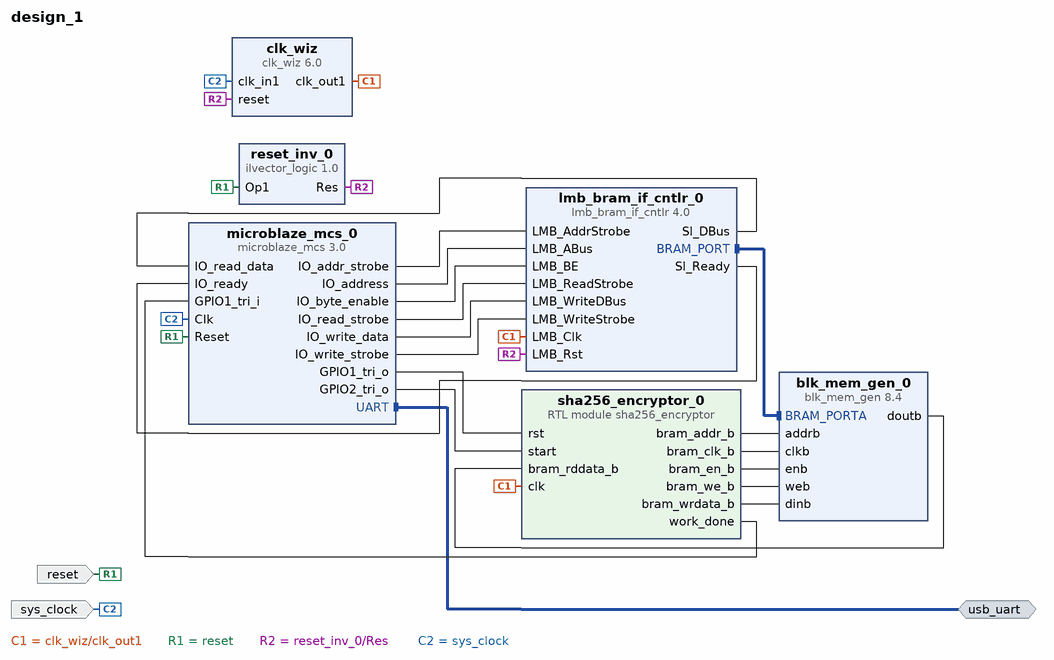
[diagram p0: block diagram of the top level]
# Vivado block design design_1, xc7a100tcsg324-1, Vivado 2025.2
create_bd_design design_1

create_bd_intf_port -mode Master -vlnv xilinx.com:interface:uart_rtl:1.0 usb_uart
create_bd_port -dir I -type rst reset
set_property -dict {CONFIG.POLARITY ACTIVE_LOW} [get_bd_ports reset]
create_bd_port -dir I -type clk sys_clock
set_property -dict {CONFIG.FREQ_HZ 100000000 CONFIG.PHASE 0.0} [get_bd_ports sys_clock]

create_bd_cell -type module -reference sha256_encryptor sha256_encryptor_0
create_bd_cell -type ip -vlnv xilinx.com:ip:blk_mem_gen:8.4 blk_mem_gen_0
set_property -dict {CONFIG.Memory_Type True_Dual_Port_RAM CONFIG.use_bram_block BRAM_Controller} [get_bd_cells blk_mem_gen_0]
create_bd_cell -type ip -vlnv xilinx.com:ip:microblaze_mcs:3.0 microblaze_mcs_0
set_property -dict [list \
  CONFIG.CLK_BOARD_INTERFACE sys_clock \
  CONFIG.GPI1_SIZE 1 \
  CONFIG.GPO1_SIZE 1 \
  CONFIG.GPO2_SIZE 1 \
  CONFIG.RESET_BOARD_INTERFACE reset \
  CONFIG.TRACE 0 \
  CONFIG.UART_BAUDRATE 115200 \
  CONFIG.UART_BOARD_INTERFACE usb_uart \
  CONFIG.USE_BOARD_FLOW true \
  CONFIG.USE_GPI1 1 \
  CONFIG.USE_GPO1 1 \
  CONFIG.USE_GPO2 1 \
  CONFIG.USE_GPO3 0 \
  CONFIG.USE_IO_BUS 1 \
] [get_bd_cells microblaze_mcs_0]
create_bd_cell -type ip -vlnv xilinx.com:ip:lmb_bram_if_cntlr:4.0 lmb_bram_if_cntlr_0
create_bd_cell -type ip -vlnv xilinx.com:ip:clk_wiz:6.0 clk_wiz
set_property -dict [list \
  CONFIG.CLKOUT1_REQUESTED_OUT_FREQ 100.0 \
  CONFIG.CLK_IN1_BOARD_INTERFACE sys_clock \
  CONFIG.RESET_BOARD_INTERFACE reset \
  CONFIG.USE_BOARD_FLOW true \
] [get_bd_cells clk_wiz]
create_bd_cell -type inline_hdl -vlnv xilinx.com:inline_hdl:ilvector_logic:1.0 reset_inv_0
set_property -dict {CONFIG.C_OPERATION not CONFIG.C_SIZE 1} [get_bd_cells reset_inv_0]

# ---- connections ----

connect_bd_intf_net [get_bd_intf_pins blk_mem_gen_0/BRAM_PORTA] [get_bd_intf_pins lmb_bram_if_cntlr_0/BRAM_PORT]
connect_bd_intf_net [get_bd_intf_ports usb_uart] [get_bd_intf_pins microblaze_mcs_0/UART]
connect_bd_net [get_bd_pins blk_mem_gen_0/doutb] [get_bd_pins sha256_encryptor_0/bram_rddata_b]
connect_bd_net [get_bd_pins clk_wiz/clk_out1] [get_bd_pins lmb_bram_if_cntlr_0/LMB_Clk] [get_bd_pins sha256_encryptor_0/clk]
connect_bd_net [get_bd_pins lmb_bram_if_cntlr_0/Sl_DBus] [get_bd_pins microblaze_mcs_0/IO_read_data]
connect_bd_net [get_bd_pins lmb_bram_if_cntlr_0/Sl_Ready] [get_bd_pins microblaze_mcs_0/IO_ready]
connect_bd_net [get_bd_pins microblaze_mcs_0/GPIO1_tri_o] [get_bd_pins sha256_encryptor_0/rst]
connect_bd_net [get_bd_pins microblaze_mcs_0/GPIO2_tri_o] [get_bd_pins sha256_encryptor_0/start]
connect_bd_net [get_bd_pins microblaze_mcs_0/IO_addr_strobe] [get_bd_pins lmb_bram_if_cntlr_0/LMB_AddrStrobe]
connect_bd_net [get_bd_pins microblaze_mcs_0/IO_address] [get_bd_pins lmb_bram_if_cntlr_0/LMB_ABus]
connect_bd_net [get_bd_pins microblaze_mcs_0/IO_byte_enable] [get_bd_pins lmb_bram_if_cntlr_0/LMB_BE]
connect_bd_net [get_bd_pins microblaze_mcs_0/IO_read_strobe] [get_bd_pins lmb_bram_if_cntlr_0/LMB_ReadStrobe]
connect_bd_net [get_bd_pins microblaze_mcs_0/IO_write_data] [get_bd_pins lmb_bram_if_cntlr_0/LMB_WriteDBus]
connect_bd_net [get_bd_pins microblaze_mcs_0/IO_write_strobe] [get_bd_pins lmb_bram_if_cntlr_0/LMB_WriteStrobe]
connect_bd_net [get_bd_ports reset] [get_bd_pins microblaze_mcs_0/Reset] [get_bd_pins reset_inv_0/Op1]
connect_bd_net [get_bd_pins reset_inv_0/Res] [get_bd_pins clk_wiz/reset] [get_bd_pins lmb_bram_if_cntlr_0/LMB_Rst]
connect_bd_net [get_bd_pins sha256_encryptor_0/bram_addr_b] [get_bd_pins blk_mem_gen_0/addrb]
connect_bd_net [get_bd_pins sha256_encryptor_0/bram_clk_b] [get_bd_pins blk_mem_gen_0/clkb]
connect_bd_net [get_bd_pins sha256_encryptor_0/bram_en_b] [get_bd_pins blk_mem_gen_0/enb]
connect_bd_net [get_bd_pins sha256_encryptor_0/bram_we_b] [get_bd_pins blk_mem_gen_0/web]
connect_bd_net [get_bd_pins sha256_encryptor_0/bram_wrdata_b] [get_bd_pins blk_mem_gen_0/dinb]
connect_bd_net [get_bd_pins sha256_encryptor_0/work_done] [get_bd_pins microblaze_mcs_0/GPIO1_tri_i]
connect_bd_net [get_bd_ports sys_clock] [get_bd_pins clk_wiz/clk_in1] [get_bd_pins microblaze_mcs_0/Clk]
set_property PFM.CLOCK {clk_out1 {id "12" is_default "true" proc_sys_reset "" status "fixed" freq_hz "100000000"}} [get_bd_cells clk_wiz]

validate_bd_design
save_bd_design
